# Altium schematic sheet 水体温盐计_原理图.SchDoc
size A4; Author: 王郡浩; DrawnBy: 王郡浩; Engineer: 王郡浩
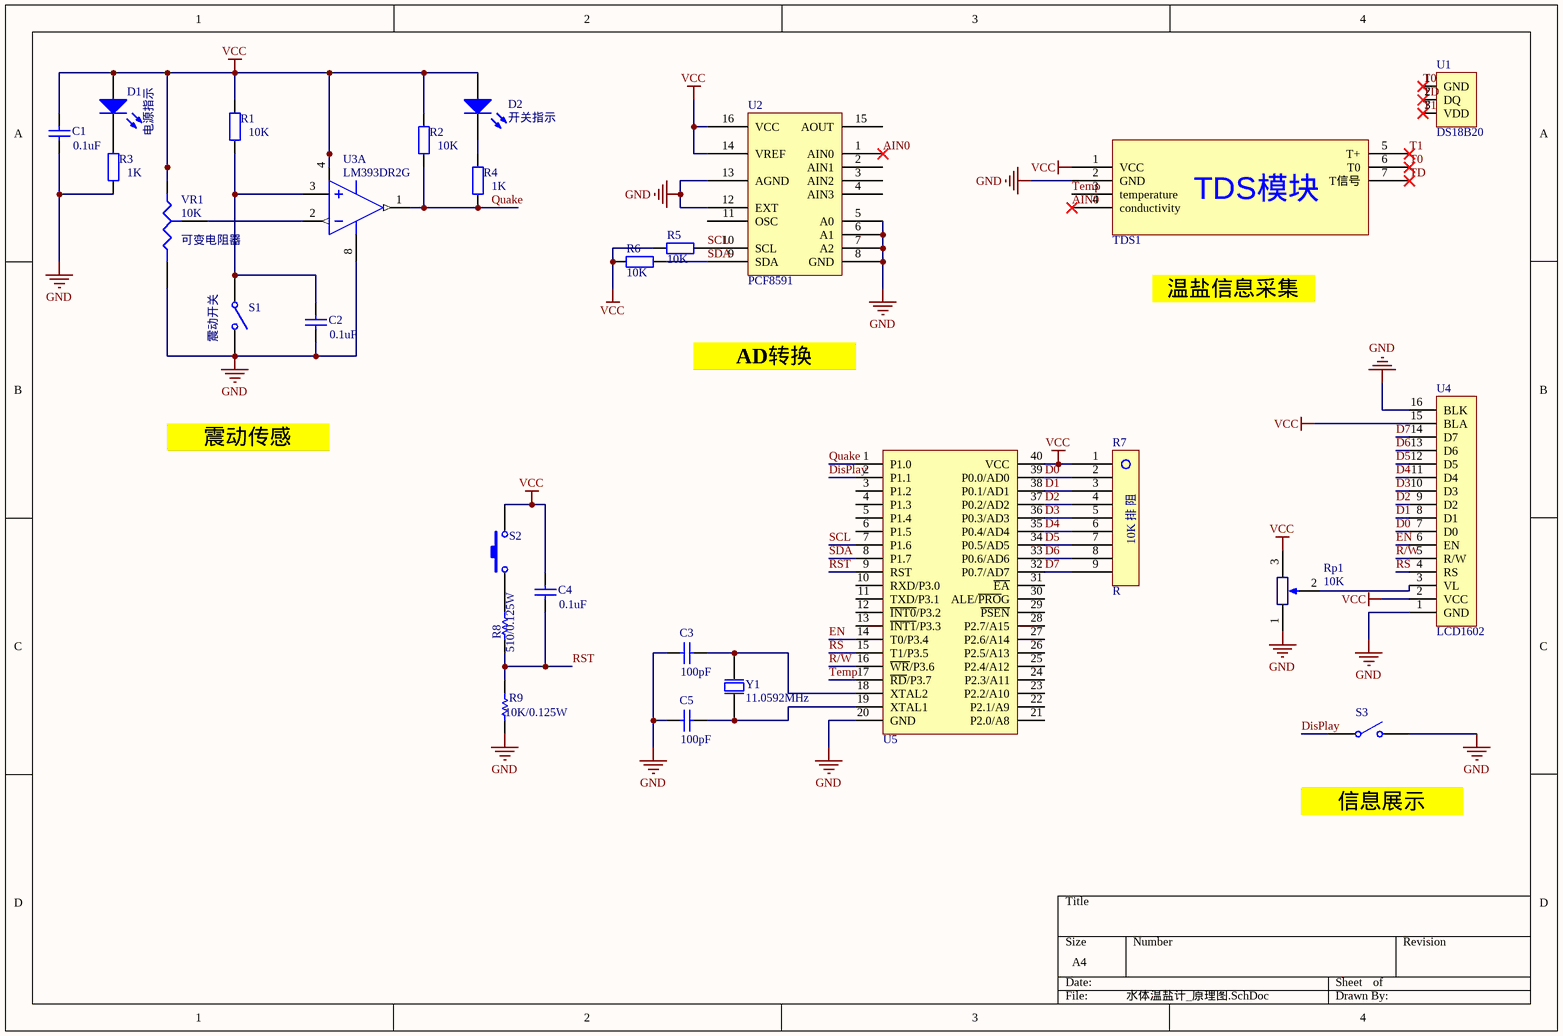
[diagram p0: 水体温盐计_原理图.SchDoc]

## Parts
C1  value 0.1uF  [RAD-0.3]  (hidden comment: Cap)
C2  value 0.1uF  [RAD-0.3]  (hidden comment: Cap)
C3  value 100pF  [RAD-0.3]  (hidden comment: Cap)
C4  value 0.1uF  [RAD-0.3]  (hidden comment: Cap)
C5  value 100pF  [RAD-0.3]  (hidden comment: Cap)
D1  电源指示  [LED-0]
D2  开关指示  [3.2X1.6X1.1]
R1  value 10K  [AXIAL-0.4]  (hidden comment: Res2)
R2  value 10K  [AXIAL-0.4]  (hidden comment: Res2)
R3  value 1K  [AXIAL-0.4]  (hidden comment: Res2)
R4  value 1K  [AXIAL-0.4]  (hidden comment: Res2)
R5  value 10K  [AXIAL-0.4]  (hidden comment: Res2)
R6  value 10K  [AXIAL-0.4]  (hidden comment: Res2)
R7  R  [HDR1X9]
R8  value 510/0.125W  [AXIAL-0.3]  (hidden comment: Res1)
R9  value 10K/0.125W  [AXIAL-0.3]  (hidden comment: Res1)
Rp1  R: 10K  [3303X-3-502E]  (hidden comment: 3303X-3-502E)
S1  震动开关  [SW_3-6-2.5]
S2  Tactile Switch  [BUTTON_6*6]  (value not drawn)
S3  S  [SW_3-6-2.5]  (value not drawn)
TDS1  TDS水质传感器  [HDR1X7]  (value not drawn)
U1  DS18B20  [HDR1X3]
U2  PCF8591  [SOT403-1_M]
U3  LM393DR2G  [SOIC-8_150mil]  (part A of 2)
U4  LCD1602  [LCD1602]
U5  AT89C51  [DIP-40]  (value not drawn)
VR1  可变电阻器  value 10K  [VR3]
Y1  Frequency: 11.0592MHz  [XTAL]  (hidden comment: XTAL)

## Nets
GND: C1.1 C2.1 C3.1 C5.1 R3.1 R9.1 Rp1.1 S1.2(NO) S3.2(NO) TDS1.2(GND) U2.5(A0) U2.6(A1) U2.7(A2) U2.8(GND) U2.12(EXT) U2.13(AGND) U3.8(V+) U4.1(GND) U4.16(BLK) U5.20(GND) VR1.2(B)
VCC: C1.2 C4.2 D1.1(A) D2.1(A) R1.2 R2.2 R5.2 R6.2 R7.1 Rp1.3 S2.2 TDS1.1(VCC) U2.14(VREF) U2.16(VCC) U3.4(GND) U4.2(VCC) U4.15(BLA) U5.40(VCC) VR1.1(A)
AIN0: TDS1.4(conductivity) U2.1(AIN0)
D0: R7.2 U4.7(D0) U5.39(P0.0/AD0)
D1: R7.3 U4.8(D1) U5.38(P0.1/AD1)
D2: R7.4 U4.9(D2) U5.37(P0.2/AD2)
D3: R7.5 U4.10(D3) U5.36(P0.3/AD3)
D4: R7.6 U4.11(D4) U5.35(P0.4/AD4)
D5: R7.7 U4.12(D5) U5.34(P0.5/AD5)
D6: R7.8 U4.13(D6) U5.33(P0.6/AD6)
D7: R7.9 U4.14(D7) U5.32(P0.7/AD7)
DisPlay: S3.1(COMMON) U5.2(P1.1)
EN: U4.6(EN) U5.14(T0/P3.4)
Quake: R2.1 R4.1 U3.1(OUT) U5.1(P1.0)
R/W: U4.5(R/W) U5.16(~{WR}/P3.6)
RS: U4.4(RS) U5.15(T1/P3.5)
RST: C4.1 R8.1 R9.2 U5.9(RST)
SCL: R5.1 U2.10(SCL) U5.7(P1.6)
SDA: R6.1 U2.9(SDA) U5.8(P1.7)
T0: TDS1.6(T0) U1.1(GND)
T1: TDS1.5(T+) U1.3(VDD)
TD: TDS1.7(T信号) U1.2(DQ)
Temp: TDS1.3(temperature) U5.17(~{RD}/P3.7)
NetC2_2: C2.2 R1.1 S1.1(COMMON) U3.3(IN+)
NetC3_2: C3.2 U5.18(XTAL2) Y1.2(OSC2)
NetC5_2: C5.2 U5.19(XTAL1) Y1.1(OSC1)
NetD1_2: D1.2(K) R3.2
NetD2_2: D2.2(K) R4.2
NetR8_2: R8.2 S2.1
NetRp1_2: Rp1.2 U4.3(VL)
NetU3_2: U3.2(IN-) VR1.3(TAP)

Not connected (* = marked no-connect by the designer): U2 2(AIN1) 3(AIN2) 4(AIN3) 11(OSC) 15(AOUT); U5 3(P1.2) 4(P1.3) 5(P1.4) 6(P1.5) 10(RXD/P3.0) 11(TXD/P3.1) 12(~{INT0}/P3.2) 13(~{INT1}/P3.3) 21(P2.0/A8) 22(P2.1/A9) 23(P2.2/A10) 24(P2.3/A11) 25(P2.4/A12) 26(P2.5/A13) 27(P2.6/A14) 28(P2.7/A15) 29(~{PSEN}) 30(ALE/~{PRO}G) 31(~{EA})

## Notes on the sheet
- 温盐信息采集
- AD转换
- 震动传感
- 信息展示
- (in symbol R) 10K 排 阻
- (in symbol TDS水质传感器) TDS模块

## Library data of the parts
C1-C5 = Cap: Capacitor; Published: 8-Jun-2000; LatestRevisionDate: 17-Jul-2002; LatestRevisionNote: Re-released for DXP Platform.; PackageReference: RAD-0.3; Publisher: Altium Limited; PackageDescription: Radial Cap, Thru-Hole; 2 Leads; 0.3 in Pin Spacing
D1 = LED0: Typical INFRARED GaAs LED; Published: 8-Jun-2000; LatestRevisionDate: 08-Jul-2005; LatestRevisionNote: Mech Layer 1 removed.; PackageReference: LED-0; Publisher: Altium Limited; PackageDescription: LED; 2 Leads
D2 = LED2: Typical RED, GREEN, YELLOW, AMBER GaAs LED; Published: 8-Jun-2000; LatestRevisionDate: 17-Jul-2002; LatestRevisionNote: Re-released for DXP Platform.; PackageVersion: Feb-2002; PackageReference: 3.2X1.6X1.1; Publisher: Altium Limited; PackageDescription: SM LED; 2 Flat Leads
R1-R6 = Res2: Resistor; Published: 8-Jun-2000; LatestRevisionDate: 17-Jul-2002; LatestRevisionNote: Re-released for DXP Platform.; PackageReference: AXIAL-0.4; Publisher: Altium Limited; PackageDescription: Axial Device, Thru-Hole; 2 Leads; 0.4 in Pin Spacing
R8 R9 = Res1: Resistor; Published: 8-Jun-2000; LatestRevisionDate: 17-Jul-2002; LatestRevisionNote: Re-released for DXP Platform.; PackageReference: AXIAL-0.3; Publisher: Altium Limited; PackageDescription: Axial Device, Thru-Hole; 2 Leads; 0.3 in Pin Spacing
Rp1 = RP_3303X-3-502E
S1 S3 = SW-SPST: Single-Pole, Single-Throw Switch; Published: 24-Mar-1999; LatestRevisionDate: 17-Jul-2002; LatestRevisionNote: Re-released for DXP Platform.; PackageReference: SPST-2; Publisher: Altium Limited
S2 = SW-PB: Tactile Switch触觉开关; Published: 24-Mar-1999; LatestRevisionDate: 17-Jul-2002; LatestRevisionNote: Re-released for DXP Platform.; PackageReference: SPST-2; Publisher: Altium Limited
U3 = LM393DR2G: 电压比较器; ComponentLink1Description: 供应商链接; ComponentLink1URL: http://www.szlcsc.com/product/details_8432.html; Package: SOIC-8; Supplier: LC; SuppliersPartNumber: C7955
U5 = AT89C51-DIP: AT89C51_DIP40
VR1 = Res Tap: Tapped Resistor; Sim Note: Enter the Resistance value and the set point into parameter fields.; Set Position: 0.5; Published: 24-Mar-1999; LatestRevisionDate: 17-Jul-2002; LatestRevisionNote: Re-released for DXP Platform.; PackageReference: VR3; Publisher: Altium Limited; PackageDescription: Variable Resistor, Thru-Hole; 3 Leads
Y1 = XTAL: Crystal Oscillator; Published: 8-Jun-2000; Revision: July-2002: Re-released for DXP Platform.; Publisher: Altium Limited